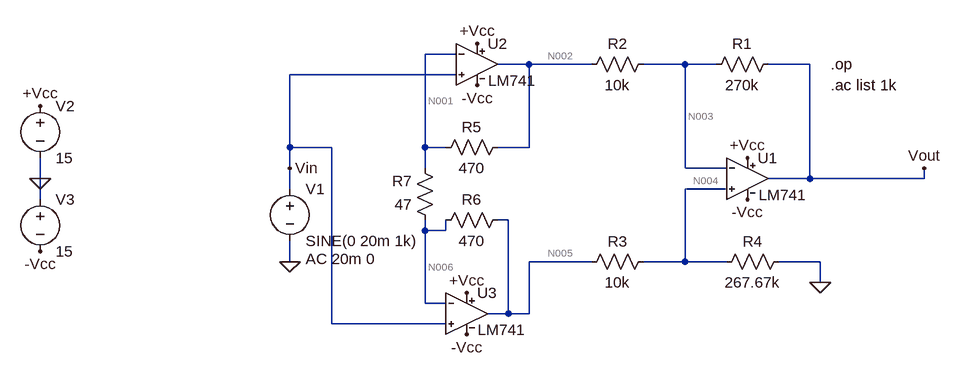
[diagram p0: schematic Expt5_Common_mode_gain.asc]
Expt5_Common_mode_gain.asc, the LTspice schematic file:
Version 4
SHEET 1 880 680
WIRE 80 -16 32 -16
WIRE 192 0 144 0
WIRE 288 0 192 0
WIRE 432 0 368 0
WIRE 480 0 432 0
WIRE 624 0 560 0
WIRE 80 16 -176 16
WIRE -176 128 -176 16
WIRE -112 128 -176 128
WIRE 32 128 32 -16
WIRE 64 128 32 128
WIRE 192 128 192 0
WIRE 192 128 144 128
WIRE -176 160 -176 128
WIRE 32 160 32 128
WIRE 432 160 432 0
WIRE 496 160 432 160
WIRE -560 176 -560 144
WIRE 624 176 624 0
WIRE 624 176 560 176
WIRE 800 176 800 160
WIRE 800 176 624 176
WIRE -176 192 -176 160
WIRE 496 192 432 192
WIRE -560 208 -560 176
WIRE 160 240 144 240
WIRE 32 256 32 240
WIRE 64 256 64 240
WIRE 64 256 32 256
WIRE -176 304 -176 272
WIRE 288 304 192 304
WIRE 432 304 432 192
WIRE 432 304 368 304
WIRE 496 304 432 304
WIRE 640 304 576 304
WIRE 640 336 640 304
WIRE 32 368 32 256
WIRE 64 368 32 368
WIRE 160 384 160 240
WIRE 160 384 128 384
WIRE 192 384 192 304
WIRE 192 384 160 384
WIRE -112 400 -112 128
WIRE 64 400 -112 400
FLAG 640 336 0
FLAG -560 176 0
FLAG -560 64 +Vcc
FLAG 528 144 +Vcc
FLAG -560 288 -Vcc
FLAG 528 208 -Vcc
FLAG 800 160 Vout
FLAG -176 160 Vin
FLAG 96 352 +Vcc
FLAG 112 -32 +Vcc
FLAG 112 32 -Vcc
FLAG 96 416 -Vcc
FLAG -176 304 0
SYMBOL LM741 528 112 R0
SYMATTR InstName U1
SYMBOL res 576 -16 R90
WINDOW 0 0 56 VBottom 2
WINDOW 3 32 56 VTop 2
SYMATTR InstName R1
SYMATTR Value 270k
SYMBOL res 384 -16 R90
WINDOW 0 0 56 VBottom 2
WINDOW 3 32 56 VTop 2
SYMATTR InstName R2
SYMATTR Value 10k
SYMBOL res 384 288 R90
WINDOW 0 0 56 VBottom 2
WINDOW 3 32 56 VTop 2
SYMATTR InstName R3
SYMATTR Value 10k
SYMBOL res 592 288 R90
WINDOW 0 0 56 VBottom 2
WINDOW 3 32 56 VTop 2
SYMATTR InstName R4
SYMATTR Value 267.67k
SYMBOL voltage -176 176 R0
WINDOW 123 24 124 Left 2
WINDOW 39 0 0 Left 2
SYMATTR Value2 AC 20m 0
SYMATTR InstName V1
SYMATTR Value SINE(0 20m 1k)
SYMBOL voltage -560 48 R0
WINDOW 123 0 0 Left 2
WINDOW 39 0 0 Left 2
SYMATTR InstName V2
SYMATTR Value 15
SYMBOL voltage -560 192 R0
WINDOW 123 0 0 Left 2
WINDOW 39 0 0 Left 2
SYMATTR InstName V3
SYMATTR Value 15
SYMBOL LM741 112 -64 R0
SYMATTR InstName U2
SYMBOL LM741 96 320 R0
SYMATTR InstName U3
SYMBOL res 160 112 R90
WINDOW 0 0 56 VBottom 2
WINDOW 3 32 56 VTop 2
SYMATTR InstName R5
SYMATTR Value 470
SYMBOL res 160 224 R90
WINDOW 0 0 56 VBottom 2
WINDOW 3 32 56 VTop 2
SYMATTR InstName R6
SYMATTR Value 470
SYMBOL res 48 256 R180
WINDOW 0 36 76 Left 2
WINDOW 3 36 40 Left 2
SYMATTR InstName R7
SYMATTR Value 47
TEXT 656 0 Left 2 !.op
TEXT 656 32 Left 2 !.ac list 1k

The netlist it stands for:
* Expt5_Common_mode_gain.asc
XU1 N004 N003 +Vcc -Vcc Vout LM741  ; pins In+ In- V+ V- OUT
R1 Vout N003 270k
R2 N003 N002 10k
R3 N004 N005 10k
R4 0 N004 267.67k
V1 Vin 0 SINE(0 20m 1k) AC 20m 0
V2 +Vcc 0 15
V3 0 -Vcc 15
XU2 Vin N001 +Vcc -Vcc N002 LM741  ; pins In+ In- V+ V- OUT
XU3 Vin N006 +Vcc -Vcc N005 LM741  ; pins In+ In- V+ V- OUT
R5 N002 N001 470
R6 N005 N006 470
R7 N006 N001 47
.op
.ac list 1k
.lib LM741.lib
.backanno
.end

* Results of the author's LTspice run, read from the files saved beside the schematic
* Operating Point, zero values left out:
*   V(n003) = 1.452 mV
*   V(n004) = 452.4 µV
*   V(-vcc) = -15 V
*   V(+vcc) = 15 V
*   V(vout) = 39.87 mV
*   V(n002) = 1.048 mV
*   V(n005) = 1.048 mV
*   V(n001) = 1 mV
*   V(n006) = 1 mV
*   I(R7) = -1.937 pA
*   I(R6) = 101.9 nA
*   I(R5) = 101.9 nA
*   I(R4) = -1.69 nA
*   I(R3) = -59.55 nA
*   I(R2) = 40.43 nA
*   I(R1) = 142.3 nA
*   I(V3) = -5.103 mA
*   I(V2) = -5.103 mA
*   I(V1) = -115.7 nA
*   Ix(u1:1) = 57.86 nA
*   Ix(u1:2) = 101.9 nA
*   Ix(u1:99) = 1.701 mA
*   Ix(u1:50) = -1.701 mA
*   Ix(u1:28) = -142.3 nA
*   Ix(u2:1) = 57.86 nA
*   Ix(u2:2) = 101.9 nA
*   Ix(u2:99) = 1.701 mA
*   Ix(u2:50) = -1.701 mA
*   Ix(u2:28) = -61.43 nA
*   Ix(u3:1) = 57.86 nA
*   Ix(u3:2) = 101.9 nA
*   Ix(u3:99) = 1.701 mA
*   Ix(u3:50) = -1.701 mA
*   Ix(u3:28) = -161.4 nA
* AC Analysis:
*   frequency = 1 k
*   V(n003) = 19.28 mV
*   V(n004) = 19.28 mV
*   V(-vcc) = 0 V
*   V(+vcc) = 0 V
*   V(vout) = -148.1 µV
*   V(n002) = 20 mV
*   V(n005) = 20 mV
*   V(vin) = 20 mV
*   V(n001) = 20 mV
*   V(n006) = 20 mV
*   I(R7) = 839.7 fA
*   I(R6) = 1.739 pA
*   I(R5) = 58.99 fA
*   I(R4) = -72.03 nA
*   I(R3) = -72.03 nA
*   I(R2) = -71.96 nA
*   I(R1) = -71.96 nA
*   I(V3) = 36 nA
*   I(V2) = -36.03 nA
*   I(V1) = 1.718 pA
*   Ix(u1:1) = -1.433 pA
*   Ix(u1:2) = 1.472 pA
*   Ix(u1:99) = -36.01 nA
*   Ix(u1:50) = -35.95 nA
*   Ix(u1:28) = 71.96 nA
*   Ix(u2:1) = -858.7 fA
*   Ix(u2:2) = 898.7 fA
*   Ix(u2:99) = 35.99 nA
*   Ix(u2:50) = 35.97 nA
*   Ix(u2:28) = -71.96 nA
*   Ix(u3:1) = -858.9 fA
*   Ix(u3:2) = 898.9 fA
*   Ix(u3:99) = 36.05 nA
*   Ix(u3:50) = 35.98 nA
*   Ix(u3:28) = -72.03 nA
* From the log:
*   Semiconductor Device Operating Points:
*                           --- Diodes ---
*   Name:    d:u3:3      d:u3:4      d:u3:6      d:u3:5      d:u3:2
*   Model:    u3:dx       u3:dx       u3:dx       u3:dx       u3:dx
*   Id:     -1.81e-13   -1.81e-13    7.63e-05    7.61e-05   -1.34e-11
*   Vd:     -1.80e-01   -1.80e-01    6.48e-01    6.48e-01   -1.34e+01
*   Req:     1.00e+12    1.00e+12    3.39e+02    3.40e+02    1.00e+12
*   CAP:     0.00e+00    0.00e+00    0.00e+00    0.00e+00    0.00e+00
*   Name:    d:u3:1      d:u2:3      d:u2:4      d:u2:6      d:u2:5
*   Model:    u3:dx       u2:dx       u2:dx       u2:dx       u2:dx
*   Id:     -1.34e-11   -1.81e-13   -1.81e-13    7.62e-05    7.62e-05
*   Vd:     -1.34e+01   -1.80e-01   -1.80e-01    6.48e-01    6.48e-01
*   Req:     1.00e+12    1.00e+12    1.00e+12    3.39e+02    3.39e+02
*   CAP:     0.00e+00    0.00e+00    0.00e+00    0.00e+00    0.00e+00
*   Name:    d:u2:2      d:u2:1      d:u1:3      d:u1:4      d:u1:6
*   Model:    u2:dx       u2:dx       u1:dx       u1:dx       u1:dx
*   Id:     -1.34e-11   -1.34e-11   -1.81e-13   -1.81e-13    7.63e-05
*   Vd:     -1.34e+01   -1.34e+01   -1.80e-01   -1.80e-01    6.48e-01
*   Req:     1.00e+12    1.00e+12    1.00e+12    1.00e+12    3.39e+02
*   CAP:     0.00e+00    0.00e+00    0.00e+00    0.00e+00    0.00e+00
*   Name:    d:u1:5      d:u1:2      d:u1:1
*   Model:    u1:dx       u1:dx       u1:dx
*   Id:      7.61e-05   -1.34e-11   -1.33e-11
*   Vd:      6.48e-01   -1.34e+01   -1.33e+01
*   Req:     3.40e+02    1.00e+12    1.00e+12
*   CAP:     0.00e+00    0.00e+00    0.00e+00
*                           --- Bipolar Transistors ---
*   Name:     q:u3:2      q:u3:1      q:u2:2      q:u2:1      q:u1:2
*   Model:     u3:qx       u3:qx       u2:qx       u2:qx       u1:qx
*   Ib:       7.99e-08    7.99e-08    7.99e-08    7.99e-08    7.99e-08
*   Ic:       4.99e-05    4.99e-05    4.99e-05    4.99e-05    4.99e-05
*   Vbe:      6.97e-01    6.97e-01    6.97e-01    6.97e-01    6.97e-01
*   Vbc:     -1.50e+01   -1.50e+01   -1.50e+01   -1.50e+01   -1.50e+01
*   Vce:      1.57e+01    1.57e+01    1.57e+01    1.57e+01    1.57e+01
*   BetaDC:   6.25e+02    6.25e+02    6.25e+02    6.25e+02    6.25e+02
*   Gm:       1.93e-03    1.93e-03    1.93e-03    1.93e-03    1.93e-03
*   Rpi:      3.24e+05    3.24e+05    3.24e+05    3.24e+05    3.24e+05
*   Rx:       0.00e+00    0.00e+00    0.00e+00    0.00e+00    0.00e+00
*   Ro:       0.00e+00    0.00e+00    0.00e+00    0.00e+00    0.00e+00
*   Cbe:      0.00e+00    0.00e+00    0.00e+00    0.00e+00    0.00e+00
*   Cbc:      0.00e+00    0.00e+00    0.00e+00    0.00e+00    0.00e+00
*   Cjs:      0.00e+00    0.00e+00    0.00e+00    0.00e+00    0.00e+00
*   BetaAC:   6.25e+02    6.25e+02    6.25e+02    6.25e+02    6.25e+02
*   Cbx:      0.00e+00    0.00e+00    0.00e+00    0.00e+00    0.00e+00
*   Ft:       0.00e+00    0.00e+00    0.00e+00    0.00e+00    0.00e+00
*   Name:     q:u1:1
*   Model:     u1:qx
*   Ib:       7.99e-08
*   Ic:       4.99e-05
*   Vbe:      6.97e-01
*   Vbc:     -1.50e+01
*   Vce:      1.57e+01
*   BetaDC:   6.25e+02
*   Gm:       1.93e-03
*   Rpi:      3.24e+05
*   Rx:       0.00e+00
*   Ro:       0.00e+00
*   Cbe:      0.00e+00
*   Cbc:      0.00e+00
*   Cjs:      0.00e+00
*   BetaAC:   6.25e+02
*   Cbx:      0.00e+00
*   Ft:       0.00e+00